# Altium schematic sheet Dali.SchDoc
size A4
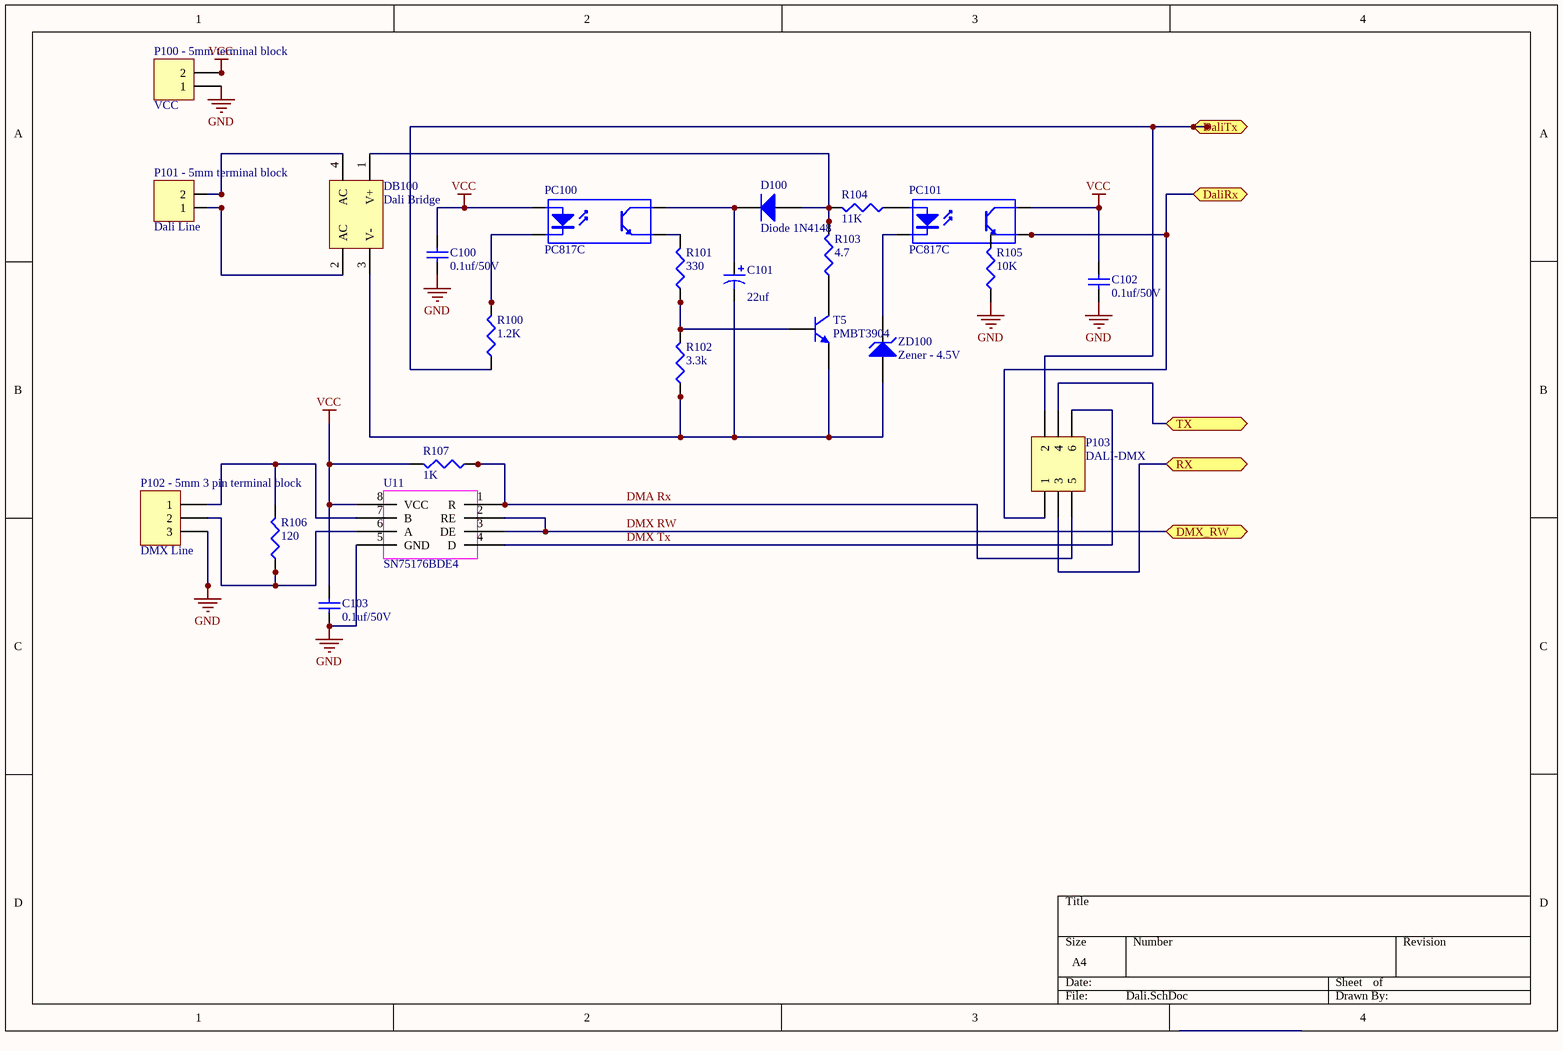
[diagram p0: Dali.SchDoc]

## Parts
C100  0.1uf/50V  [CC3225-1210]
C101  value 22uf  [CAPPR2.5-6.3x5]  (hidden comment: 22uf/16v)
C102  0.1uf/50V  [CC3225-1210]
C103  0.1uf/50V  [CC3225-1210]
D100  Diode 1N4148  [DO-35]
DB100  Dali Bridge  [SDIP]
P100_-_5mm_terminal_block  VCC  [HDR1X2]
P101_-_5mm_terminal_block  Dali Line  [HDR1X2]
P102_-_5mm_3_pin_terminal_block  DMX Line  [HDR1X3]
P103  DALI-DMX  [HDR2X3]
PC100  PC817C  [DIP-4]
PC101  PC817C  [DIP-4]
R100  value 1.2K  [CR2012-0805]  (hidden comment: CR2012-0805)
R101  value 330  [CR2012-0805]  (hidden comment: CR2012-0805)
R102  value 3.3k  [CR2012-0805]  (hidden comment: CR2012-0805)
R103  value 4.7  [CR2012-0805]  (hidden comment: CR2012-0805)
R104  value 11K  [CR2012-0805]  (hidden comment: CR2012-0805)
R105  value 10K  [CR2012-0805]  (hidden comment: CR2012-0805)
R106  value 120  [CR2012-0805]  (hidden comment: CR2012-0805)
R107  value 1K  [CR2012-0805]  (hidden comment: CR2012-0805)
T5  PMBT3904  [SOT23_N]
U11  SN75176BDE4  [8-SOIC (0.154", 3.90mm Width)]
ZD100  Zener - 4.5V  [DIODE-0.7]

## Ports
DaliRx, DaliTx, DMX_RW, RX, TX

## Nets
GND: C100.1 C102.1 C103.1 P100_-_5mm_terminal_block.1 P102_-_5mm_3_pin_terminal_block.3 R105.1 U11.5(GND)
VCC: C100.2 C102.2 C103.2 P100_-_5mm_terminal_block.2 PC100.1(A) PC101.4(C) R107.2 U11.8(VCC)
DaliRx: P103.1 PC101.3(E) R105.2 ; port DaliRx
DaliTx: P103.2 R100.1 ; port DaliTx
DMA Rx: P103.5 R107.1 U11.1(R)
DMX RW: U11.2(RE) U11.3(DE) ; port DMX_RW
DMX Tx: P103.6 U11.4(D)
RX: P103.3 ; port RX
TX: P103.4 ; port TX
NetC101_1: C101.1 D100.2(K) PC100.4(C)
NetC101_2: C101.2 DB100.3(V-) R102.1 T5.2(E) ZD100.1(A)
NetD100_1: D100.1(A) DB100.1(V+) R103.2 R104.2
NetDB100_2: DB100.2(AC) P101_-_5mm_terminal_block.1
NetDB100_4: DB100.4(AC) P101_-_5mm_terminal_block.2
NetP102_-_5mm_3_pin_terminal_block_1: P102_-_5mm_3_pin_terminal_block.1 R106.2 U11.7(B)
NetP102_-_5mm_3_pin_terminal_block_2: P102_-_5mm_3_pin_terminal_block.2 R106.1 U11.6(A)
NetPC100_2: PC100.2(K) R100.2
NetPC100_3: PC100.3(E) R101.2
NetPC101_1: PC101.1(A) R104.1
NetPC101_2: PC101.2(K) ZD100.2(K)
NetR101_1: R101.1 R102.2 T5.1(B)
NetR103_1: R103.1 T5.3(C)

## Library data of the parts
C100 C102 C103 = Cap: Capacitor; Value: 0.1uf; Published: 8-Jun-2000; LatestRevisionDate: 17-Jul-2002; LatestRevisionNote: Re-released for DXP Platform.; PackageReference: RAD-0.3; Publisher: Altium Limited; PackageDescription: Radial Cap, Thru-Hole; 2 Leads; 0.3 in Pin Spacing
C101 = Cap Pol1: Polarized Capacitor (Radial); Published: 8-Jun-2000; LatestRevisionDate: 17-Jul-2002; LatestRevisionNote: Re-released for DXP Platform.; PackageReference: RB7.6-15; Publisher: Altium Limited; PackageDescription: Polarized Capacitor (Radial); 2 Leads
D100 = Diode 1N4148: High Conductance Fast Diode; Published: 8-Jun-2000; LatestRevisionDate: 17-Jul-2002; LatestRevisionNote: Re-released for DXP Platform.; DatasheetVersion: 1997; PackageReference: DO-35; Publisher: Altium Limited; PackageDescription: Diode, Axial; Body 3.8 x 1.9 mm (LxDia. max), Lead Dia. 0.53 mm (max); Code_JEDEC: DO-204-AH; ComponentLink1Description: Manufacturer Link; ComponentLink1URL: http://www.fairchildsemi.com/; ComponentLink2Description: Datasheet; ComponentLink2URL: http://www.fairchildsemi.com/ds/1N%2F1N4148.pdf
DB100 = Bridge2: Diode Bridge; Published: 24-Mar-1999; LatestRevisionDate: 17-Jul-2002; LatestRevisionNote: Re-released for DXP Platform.; PackageReference: D-46_6A; Publisher: Altium Limited; PackageDescription: Bridge Rectifier; 4 Terminals; Body 16.8 x 16.8 mm (typ); Pitch 10.67 mm
P100_-_5mm_terminal_block P101_-_5mm_terminal_block = Header 2: Header, 2-Pin; LatestRevisionDate: 17-Jul-2002; LatestRevisionNote: Re-released for DXP Platform.; Publisher: Altium Limited
P102_-_5mm_3_pin_terminal_block = Header 3: Header, 3-Pin; LatestRevisionDate: 17-Jul-2002; LatestRevisionNote: Re-released for DXP Platform.; Publisher: Altium Limited
P103 = Header 3X2: Header, 3-Pin, Dual row; LatestRevisionDate: 17-Jul-2002; LatestRevisionNote: Re-released for DXP Platform.; Publisher: Altium Limited
PC100 PC101 = Optoisolator1: 4-Pin Phototransistor Optocoupler; Published: 24-Mar-1999; LatestRevisionDate: 04-Mar-2005; LatestRevisionNote: Sch pins 3 & 4 Swapped.; DatasheetVersion: Nov-2003; PackageReference: DIP-4; Publisher: Altium Limited
R100-R107 = Res3: Resistor; Published: 8-Jun-2000; LatestRevisionDate: 29-May-2009; LatestRevisionNote: IPC-7351 Footprint Added.; PackageReference: CR2012-0805; Publisher: Altium Limited; PackageDescription: Chip Resistor
T5 = PMBT3904: NPN Switching Transistor; Published: 17-Sep-2003; LatestRevisionDate: 12-Dec-2006; LatestRevisionNote: IPC-7351 Footprint Added.; DatasheetVersion: 27-Apr-1999; PackageVersion: May-1999; PackageReference: SOT23; Publisher: Altium Limited; PackageDescription: 3-Pin SOT-23 Package 0.95 mm Pitch, 2.3 mm Lead Span; ComponentLink1Description: Manufacturer Link; ComponentLink1URL: http://www.semiconductors.philips.com/; ComponentLink2Description: Datasheet; ComponentLink2URL: http://www.semiconductors.philips.com/acrobat/datasheets/PMBT3904_4.pdf
U11 = Component_1
ZD100 = D Zener: Zener Diode; Published: 8-Jun-2000; LatestRevisionDate: 17-Jul-2002; LatestRevisionNote: Re-released for DXP Platform.; PackageReference: DIODE-0.7; Publisher: Altium Limited; PackageDescription: Diode, Thru-Hole; 2 Leads; 0.7 in Pin Spacing